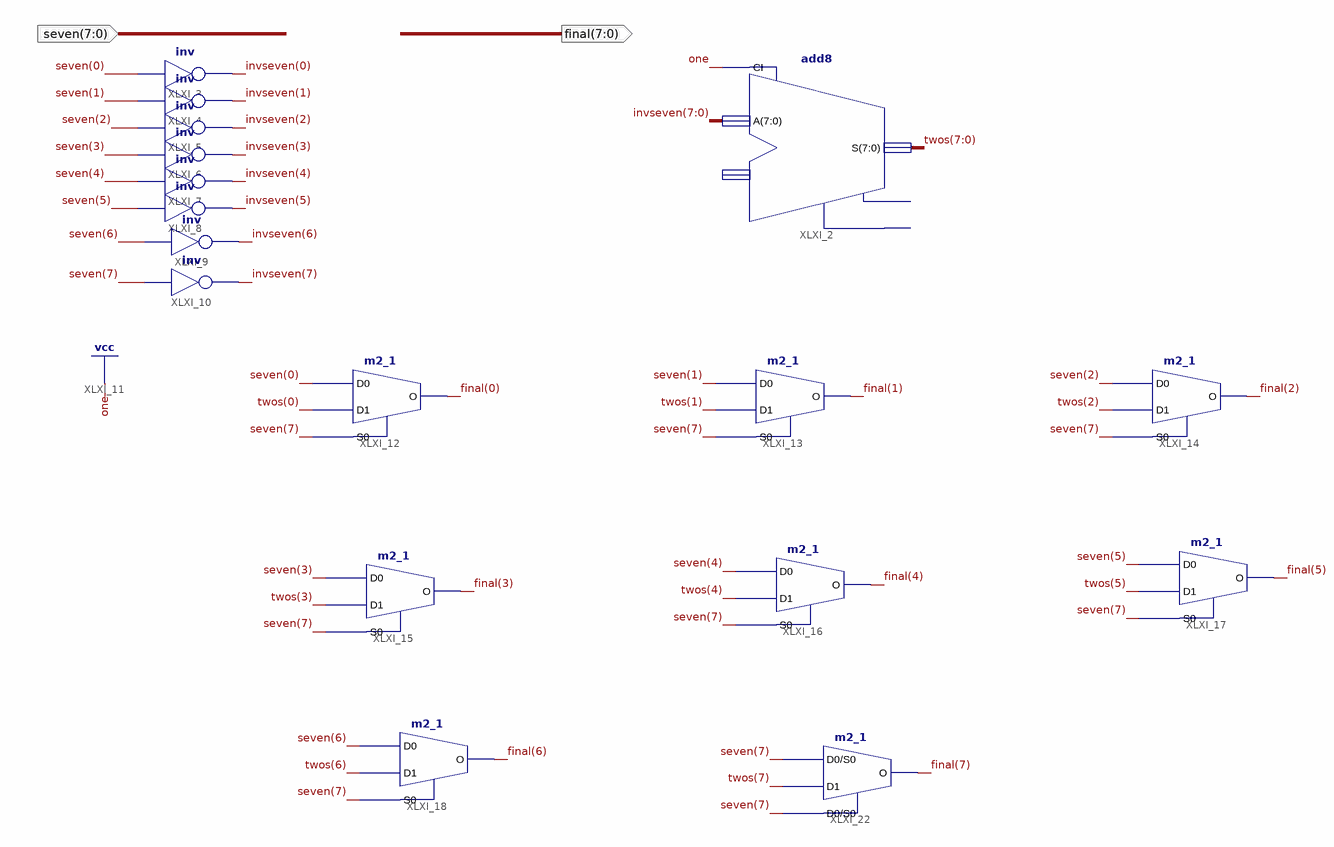
[diagram p0: schematic sheet 1]
// Xilinx ISE schematic twocompliment.sch (spartan3e) as structural Verilog: 17 symbols, 2 ports
module twocompliment (
  input  [7:0] seven,
  output [7:0] \final 
);

  wire [7:0] invseven, twos;

  add8 XLXI_2 (.A(invseven), .CI(1'b1), .S(twos));  // open: B, CO, OFL
  not XLXI_3 (invseven[0], seven[0]);
  not XLXI_4 (invseven[1], seven[1]);
  not XLXI_5 (invseven[2], seven[2]);
  not XLXI_6 (invseven[3], seven[3]);
  not XLXI_7 (invseven[4], seven[4]);
  not XLXI_8 (invseven[5], seven[5]);
  not XLXI_9 (invseven[6], seven[6]);
  not XLXI_10 (invseven[7], seven[7]);
  m2_1 XLXI_12 (.D0(seven[0]), .D1(twos[0]), .S0(seven[7]), .O(\final [0]));
  m2_1 XLXI_15 (.D0(seven[3]), .D1(twos[3]), .S0(seven[7]), .O(\final [3]));
  m2_1 XLXI_16 (.D0(seven[4]), .D1(twos[4]), .S0(seven[7]), .O(\final [4]));
  m2_1 XLXI_17 (.D0(seven[5]), .D1(twos[5]), .S0(seven[7]), .O(\final [5]));
  m2_1 XLXI_18 (.D0(seven[6]), .D1(twos[6]), .S0(seven[7]), .O(\final [6]));
  m2_1 XLXI_13 (.D0(seven[1]), .D1(twos[1]), .S0(seven[7]), .O(\final [1]));
  m2_1 XLXI_14 (.D0(seven[2]), .D1(twos[2]), .S0(seven[7]), .O(\final [2]));
  m2_1 XLXI_22 (.D0(seven[7]), .D1(twos[7]), .S0(seven[7]), .O(\final [7]));
endmodule
